# EAGLE design LightSensorCircuitNoAmp (EAGLE 9.6.2)
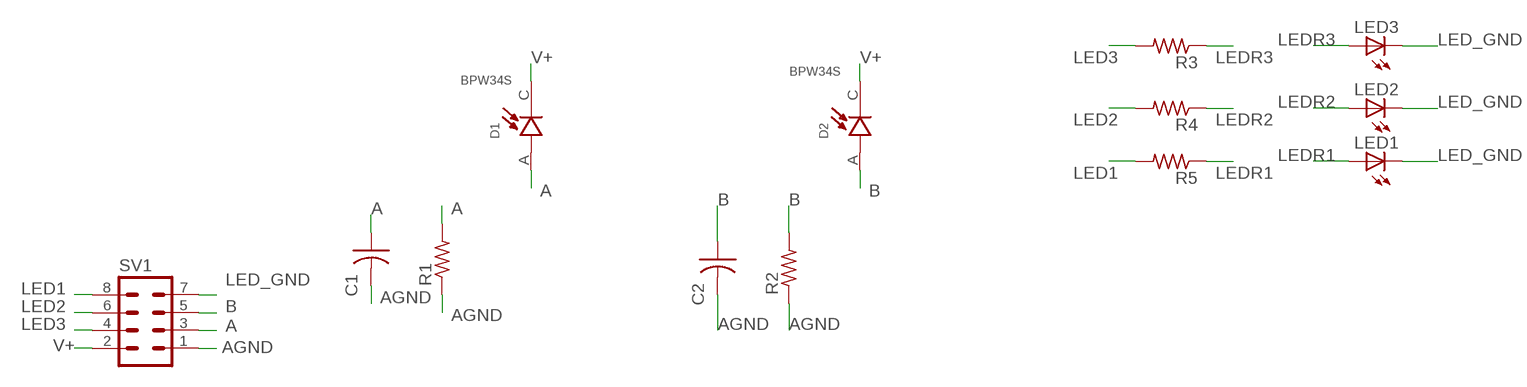
[diagram p0: schematic, sheet 1]

## Parts
C1  C-US025-025X050  [C025-025X050]
C2  C-US025-025X050  [C025-025X050]
D1  BPW34S  [DIO_BPW34S]
D2  BPW34S  [DIO_BPW34S]
LED1  LEDCHIPLED_1206  [CHIPLED_1206]
LED2  LEDCHIPLED_1206  [CHIPLED_1206]
LED3  LEDCHIPLED_1206  [CHIPLED_1206]
R1  R-US_0204/5  [0204/5]
R2  R-US_0204/5  [0204/5]
R3  R-US_0204/5  [0204/5]
R4  R-US_0204/5  [0204/5]
R5  R-US_0204/5  [0204/5]
SV1  MA04-2  [MA04-2]

## Nets
A: C1.1 D1.A R1.2 SV1.3
AGND: C1.2 C2.2 R1.1 R2.1 SV1.1
B: C2.1 D2.A R2.2 SV1.5
LED1: R5.2 SV1.8
LED2: R4.2 SV1.6
LED3: R3.2 SV1.4
LED_GND: LED1.C LED2.C LED3.C SV1.7
LEDR1: LED1.A R5.1
LEDR2: LED2.A R4.1
LEDR3: LED3.A R3.1
V+: D1.C D2.C SV1.2

## Library data of the parts
C1 C2 = adafruit:C-US: CAPACITOR, American symbol
D1 D2 = BPW34S:BPW34S: PHOTODIODE; Wavelength Typ: 850nm; Sensitivity: 0.62A/W; Half Angle: 60°; Dark Current: 2nA; No. of Pins: 2; Check availability <https://pricing.snapeda.com/parts/BPW34S/Vishay%20Semiconductor%20Opto%20Division/view-part?ref=eda>; AVAILABILITY: In Stock; DESCRIPTION: Photodiode 900nm - 130° 2-DIP; MF: Vishay Semiconductor Opto Division; MP: BPW34S; PACKAGE: None; PRICE: None; PURCHASE-URL: https://pricing.snapeda.com/search/part/BPW34S/?ref=eda
LED1-LED3 = adafruit:LED: LED OSRAM: - CHIPLED LG R971, LG N971, LY N971, LG Q971, LY Q971, LO R971, LY R971 LH N974, LH R974 LS Q976, LO Q976, LY Q976 LO Q996 - Hyper CHIPLED LW Q18S LB Q993, LB Q99A, LB R99A - SideLED LS A670, LO A670, LY A670, LG A670, LP A670 LB A673, LV A673, LT A673, LW A673 LH A674 LY A675 LS A676, LA A676, LO A676, LY A676, LW A676 LS A679, LY A679, LG A679 - Hyper Micro SIDELED® LS Y876, LA Y876, LO Y876, LY Y876 LT Y87S - SmartLED LW L88C, LW L88S LB L89C, LB L89S, LG L890 LS L89K, LO L89K, LY L89K LS L896, LA L896, LO L896, LY L896 - TOPLED LS T670, LO T670, LY T670, LG T670, LP T670 LSG T670, LSP T670, LSY T670, LOP T670, LYG T670 LG T671, LOG T671, LSG T671 LB T673, LV T673, LT T673, LW T673 LH T674 LS T676, LA T676, LO T676, LY T676, LB T676, LH T676, LSB T676, LW T676 LB T67C, LV T67C, LT T67C, LS T67K, LO T67K, LY T67K, LW E67C LS E67B, LA E67B, LO E67B, LY E67B, LB E67C, LV E67C, LT E67C LW T67C LS T679, LY T679, LG T679 LS T770, LO T770, LY T770, LG T770, LP T770 LB T773, LV T773, LT T773, LW T773 LH T774 LS E675, LA E675, LY E675, LS T675 LS T776, LA T776, LO T776, LY T776, LB T776 LHGB T686 LT T68C, LB T68C - Hyper Mini TOPLED® LB M676 - Mini TOPLED Santana® LG M470 LS M47K, LO M47K, LY M47K Source: http://www.osram.convergy.de/
R1-R5 = adafruit:R-US_: RESISTOR, American symbol
SV1 = con-lstb:MA04-2: PIN HEADER; OC_FARNELL: unknown; OC_NEWARK: unknown

## Board
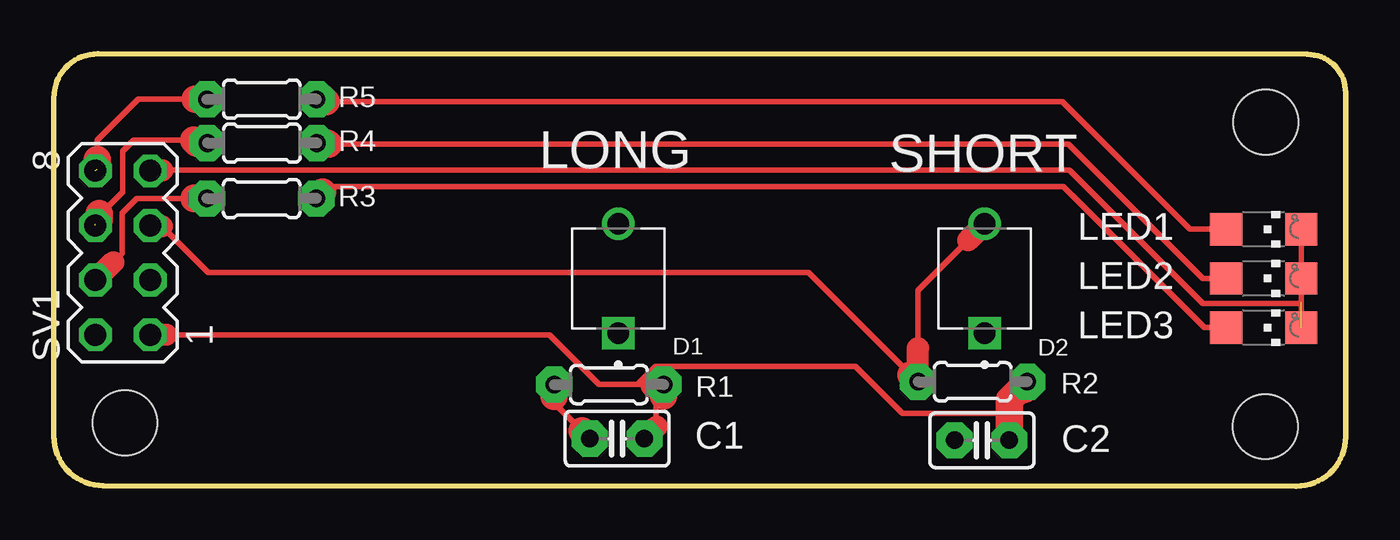
[diagram p1: board, top side]
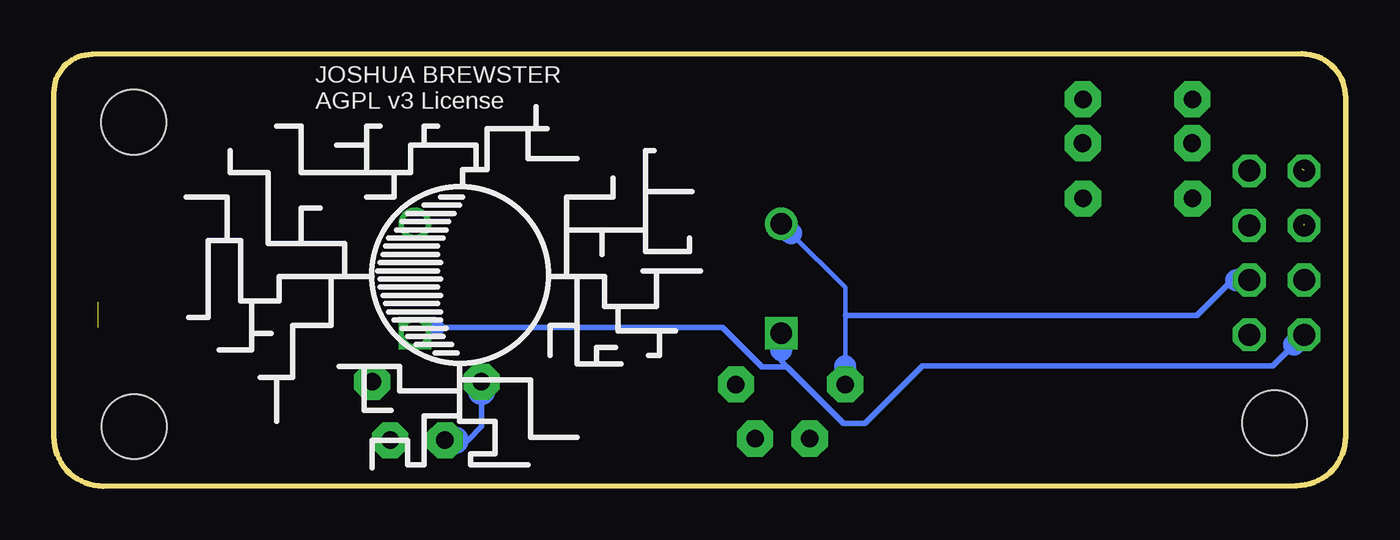
[diagram p2: board, bottom side, seen from below]

Size 59.99 x 20.09 mm. Coordinates in mm from the lower left corner, seen from the top.
Outline: 0,18.06 arc-90 2.03,20.09 58.22,20.07 arc-90 59.99,18.29 59.99,2.29 arc-90 57.71,0 2.29,0.03 arc-90 0,2.31 0,18.06
Copper layers (1*16): Top 0.035mm / dielectric 1.5mm / Bottom 0.035mm
Design rules "default *": minimum track width 6mil, minimum drill 0.35mm, track to track 6mil, track to pad 6mil, pad to pad 6mil, via to via 6mil, smd to smd 6mil, copper to edge 10mil, drill to drill 6mil, minimum pad ring 10mil, minimum via ring 8mil, stop-mask expansion 4mil, vias tented up to drill 0mil, thermal gap 10mil
Holes 3 mm at 56.29,16.92 56.26,2.77 3.3,2.95

### Footprints (pad centres in the part's own frame; a part is rotated, then mirrored left to right if it is on the bottom)
C025-025X050 = drill 0.813 pad 1.676 octagon: 1 -1.27,0; 2 1.27,0
DIO_BPW34S = drill 1 pad 1.5: A 2.55,0 | drill 1 pad 1.5 square: C -2.55,0
CHIPLED_1206 = smd 1.5 x 1.5: A 0,-1.75; C 0,1.75
0204/5 = drill 0.813 pad 1.676 octagon: 1 -2.54,0; 2 2.54,0
MA04-2 = drill 1.016 octagon: 1 -3.81,-1.27; 2 -3.81,1.27; 3 -1.27,-1.27; 4 -1.27,1.27; 5 1.27,-1.27; 6 1.27,1.27; 7 3.81,-1.27; 8 3.81,1.27

### Placement (x,y rotation side)
C1  26.16,2.21 0 top
C2  43.1,2.13 0 top
D1  26.21,9.65 90 top
D2  43.23,9.65 90 top
LED1  56.18,11.94 270 top
LED2  56.18,9.65 270 top
LED3  56.18,7.37 270 top
R1  25.78,4.72 180 top
R2  42.67,4.85 180 top
R3  9.65,13.37 180 top
R4  9.67,15.94 180 top
R5  9.66,17.98 180 top
SV1  3.2,10.85 90 top

### Tracks (layer width: path | path; a pad name or v marks a point on that pad's centre or on a via)
A
  Top 0.254: 24.54,2.56 23.24,3.86 23.24,4.17
  Top 1.27: C1.1 24.54,2.56 | R1.2 23.24,4.17
  Bottom 0.203: 25.75,11.74 23.24,9.23 23.24,7.92 23.24,5.59
  Bottom 0.254: 23.24,7.92 6.91,7.92 5.26,9.58 5.08,9.58
  Bottom 1.016: D1.A 25.75,11.74 | R1.2 23.24,5.59 | SV1.3 5.08,9.58
AGND
  Top 0.203: 5.31,7.04 5.23,7.04
  Top 0.254: 45.08,4.5 43.97,3.38 39.42,3.38 37.24,5.56 27.94,5.56 27.1,4.72 | 5.31,7.04 23.01,7.04 25.32,4.72 27.1,4.72 | 27.1,4.72 R1.1 | 28.32,4.19 27.97,3.83 27.97,2.79 27.99,2.77
  Top 1.016: 5.23,7.04 SV1.1 | C2.2 44.25,2.26 44.25,2.69 44.37,2.82 | C1.2 27.99,2.77
  Top 1.27: 44.37,2.82 44.37,4.01 R2.1 45.21,4.62 45.08,4.5 | 27.86,4.72 R1.1 28.32,4.19
B
  Top 0.254: 39.81,5.17 35.05,9.93 7.16,9.93 5.03,12.06 | 42.46,11.44 40.12,9.09 40.12,6.41
  Top 1.016: R2.2 40.13,6.4 40.12,6.41 | D2.A 42.46,11.44 | 5.03,12.06 4.52,12.06 SV1.5
  Top 1.27: R2.2 39.81,5.17
  Bottom 0.254: 41.35,2.13 40.77,2.13 40.13,2.77 40.13,4.39
  Bottom 1.27: R2.2 40.13,4.39 | C2.1 41.35,2.13
LED1  (1 unrouted)
  Top 0.254: 6.55,17.98 3.91,17.98 2.01,16.08 2.01,15.16
  Top 1.27: 2.01,15.16 2.01,14.73 | R5.2 6.55,17.98
LED2  (1 unrouted)
  Top 0.254: 6.5,16.08 3.71,16.08 3.2,15.57 3.2,13.67 2.21,12.67 2.11,12.67
  Top 1.27: 1.93,12.19 2.11,12.37 2.11,12.67 | R4.2 6.64,15.94 6.5,16.08
LED3
  Top 0.254: 2.77,10.41 3.17,10.82 3.17,12.7 3.84,13.37 R3.2
  Top 1.016: 2.77,10.41 SV1.4
  Top 1.27: R3.2 6.53,13.37 6.51,13.38
LED_GND  (1 unrouted)
  Top 0.254: LED3.C 57.93,8.5 53.35,8.5 47.17,14.68 5.05,14.68 | 57.93,8.57 LED2.C LED1.C
  Top 1.016: SV1.7 4.49,14.68 5.05,14.68
LEDR1
  Top 0.254: LED1.A 52.76,11.94 46.84,17.86 12.65,17.86
  Top 1.27: 12.65,17.86 12.45,18.06 12.27,18.06 R5.1
LEDR2
  Top 0.254: 12.75,15.89 47.13,15.89 53.37,9.65 LED2.A
  Top 1.27: R4.1 12.7,15.94 12.75,15.89
LEDR3
  Top 0.254: LED3.A 53.44,7.37 46.88,13.93 12.76,13.93 12.49,13.67
  Top 1.27: R3.1 12.49,13.67
V+
  Bottom 0.254: 2.4,6.57 3.38,5.59 19.66,5.59 22.33,2.92 23.32,2.92 25.95,5.55 | 26.21,6.33 26.21,5.82 25.95,5.55 | 42.37,7.37 28.93,7.37 27.11,5.55 25.95,5.55
  Bottom 1.016: D1.C 26.21,6.33 | SV1.2 2.4,6.57 | D2.C 42.97,7.37 42.37,7.37

### Text on the board
tPlace: LONG | SHORT
bNames: JOSHUA BREWSTER / AGPL v3 License